# EAGLE design Rapid_Feeder_Master_RS485_traces_Star (EAGLE 9.6.2)
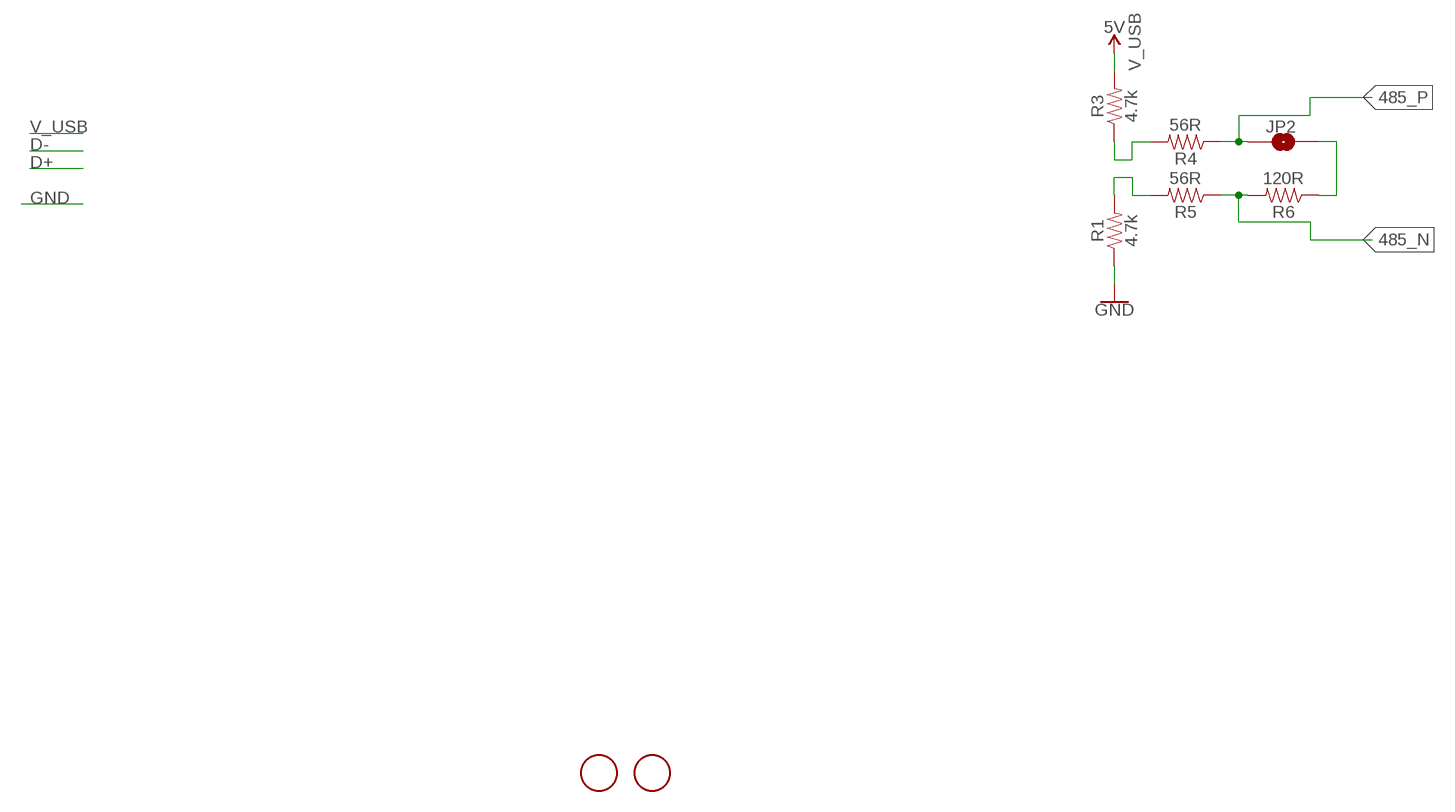
[diagram p0: schematic, sheet 1]

## Parts
JP2  JUMPER-SMT_2_NO_NO-SILK  [SMT-JUMPER_2_NO_NO-SILK]
R1  4.7k  RESISTORSR0603  [R0603]
R3  4.7k  RESISTORSR0603  [R0603]
R4  56R  RESISTORSR0603  [R0603]
R5  56R  RESISTORSR0603  [R0603]
R6  120R  RESISTORSR0603  [R0603]
U$1  FIDUCIAL  [FIDUCIAL_1MM]
U$2  FIDUCIAL  [FIDUCIAL_1MM]

## Nets
485_N: R5.1 R6.2
485_P: JP2.1 R4.1
GND: R1.1
N$2: R3.1 R4.2
N$3: R1.2 R5.2
N$4: JP2.2 R6.1
V_USB: R3.2 ; supply symbol labelled 5V

## Library data of the parts
JP2 = SparkFun-Jumpers:JUMPER-SMT_2_NO: Normally open jumper This jumper has two pads in close proximity to each other. Apply solder to close the connection. Round pads are easier to solder for beginners, but are a lot larger. SparkFun Product that uses the round pads: SparkFun EL Sequencer <https://www.sparkfun.com/products/12781>
R1 R3-R6 = My-custom-components:RESISTORS
U$1 U$2 = adafruit:FIDUCIAL: For use by pick and place machines to calibrate the vision/machine, 1mm By microbuilder.eu

## Net classes
1 diff pairs: width 0.203 mm, drill 0.35 mm, clearance 0.203 mm
4 aref: width 0.254 mm, drill 0.499 mm, clearance 0.254 mm

## Board
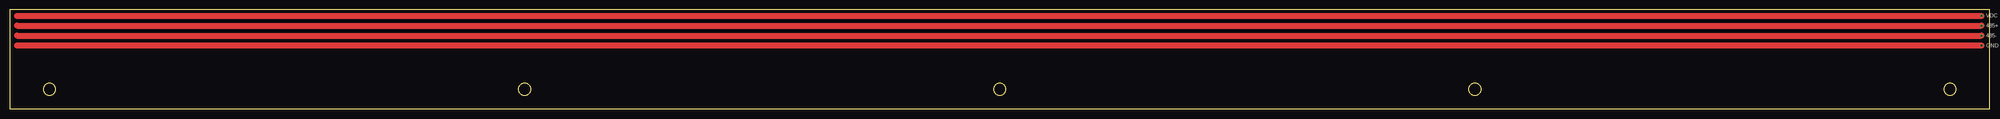
[diagram p1: board, top side]
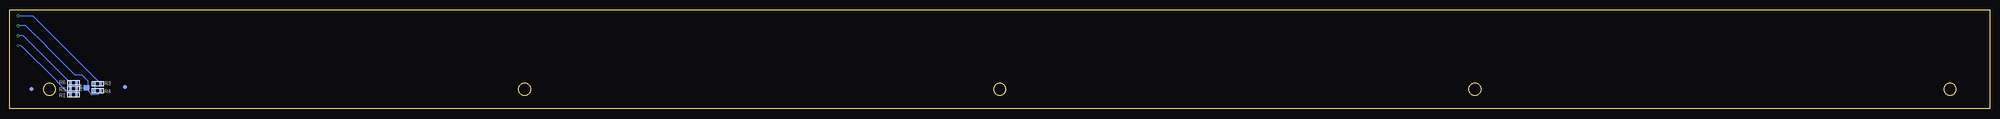
[diagram p2: board, bottom side, seen from below]

Size 500 x 25 mm. Coordinates in mm from the lower left corner, seen from the top.
Outline: 0,25 0,0 500,0 500,25 0,25
Outline: circle at 250,5 radius 1.5
Outline: circle at 490,5 radius 1.5
Outline: circle at 130,5 radius 1.5
Outline: circle at 10,5 radius 1.5
Outline: circle at 370,5 radius 1.5
Copper layers (1*16): Top 0.035mm / dielectric 1.5mm / Bottom 0.035mm
Design rules "default *": minimum track width 6mil, minimum drill 0.3mm, track to track 6mil, track to pad 6mil, pad to pad 6mil, via to via 6mil, smd to smd 6mil, copper to edge 40mil, drill to drill 6mil, minimum pad ring 10mil, minimum via ring 8mil, stop-mask expansion 4mil, vias tented up to drill 0.3mm, thermal gap 10mil

### Footprints (pad centres in the part's own frame; a part is rotated, then mirrored left to right if it is on the bottom)
SMT-JUMPER_2_NO_NO-SILK = smd 0.635 x 1.27: 1 -0.406,0; 2 0.406,0
R0603 = smd 0.889 x 0.889: 1 0,0.762; 2 0,-0.762
FIDUCIAL_1MM = smd 1 x 1: 1 0,0

### Placement (x,y rotation side)
JP2  480.64,5.33 180 bottom
R1  483.95,3.56 90 bottom
R3  477.85,6.35 90 bottom
R4  477.85,4.57 270 bottom
R5  483.95,5.08 90 bottom
R6  483.95,6.6 270 bottom
U$1  470.92,5.51 0 bottom
U$2  494.54,5 0 bottom

### Tracks (layer width: path | path; a pad name or v marks a point on that pad's centre or on a via)
485_N  (via drill 0.3)
  Top 1.5: 1.84,18.5 v497.95,18.5
  Bottom 0.203: R5.1 R6.2 496.6,18.5 v497.95,18.5
485_P  (via drill 0.3)
  Top 1.5: 1.84,21 v497.95,21
  Bottom 0.203: R4.1 477.09,4.32 477.79,3.62 479.29,3.62 480.24,4.57 JP2.1 480.24,7.04 481.75,8.55 483.45,8.55 490.65,15.74 490.69,15.74 490.77,15.82 490.86,15.87 490.87,15.92 495.95,21 v497.95,21
GND  (via drill 0.3)
  Top 1.5: v497.95,16 1.84,16
  Bottom 0.203: v497.95,16 497.89,15.95 497.1,15.95 488.35,7.2 488.05,6.95 487.8,6.65 R1.1
N$2
  Bottom 0.203: R3.1 R4.2
N$3
  Bottom 0.203: R5.2 R1.2
N$4
  Bottom 0.203: R6.1 481.91,5.33 JP2.2
V_USB  (via drill 0.3)
  Top 1.5: 1.84,23.5 v497.95,23.5
  Bottom 0.203: v497.95,23.5 494.24,23.5 R3.2

### Text on the board
tPlace: VDC / 485+ / 485- / GND